# EAGLE design meter (EAGLE 9.1.3)
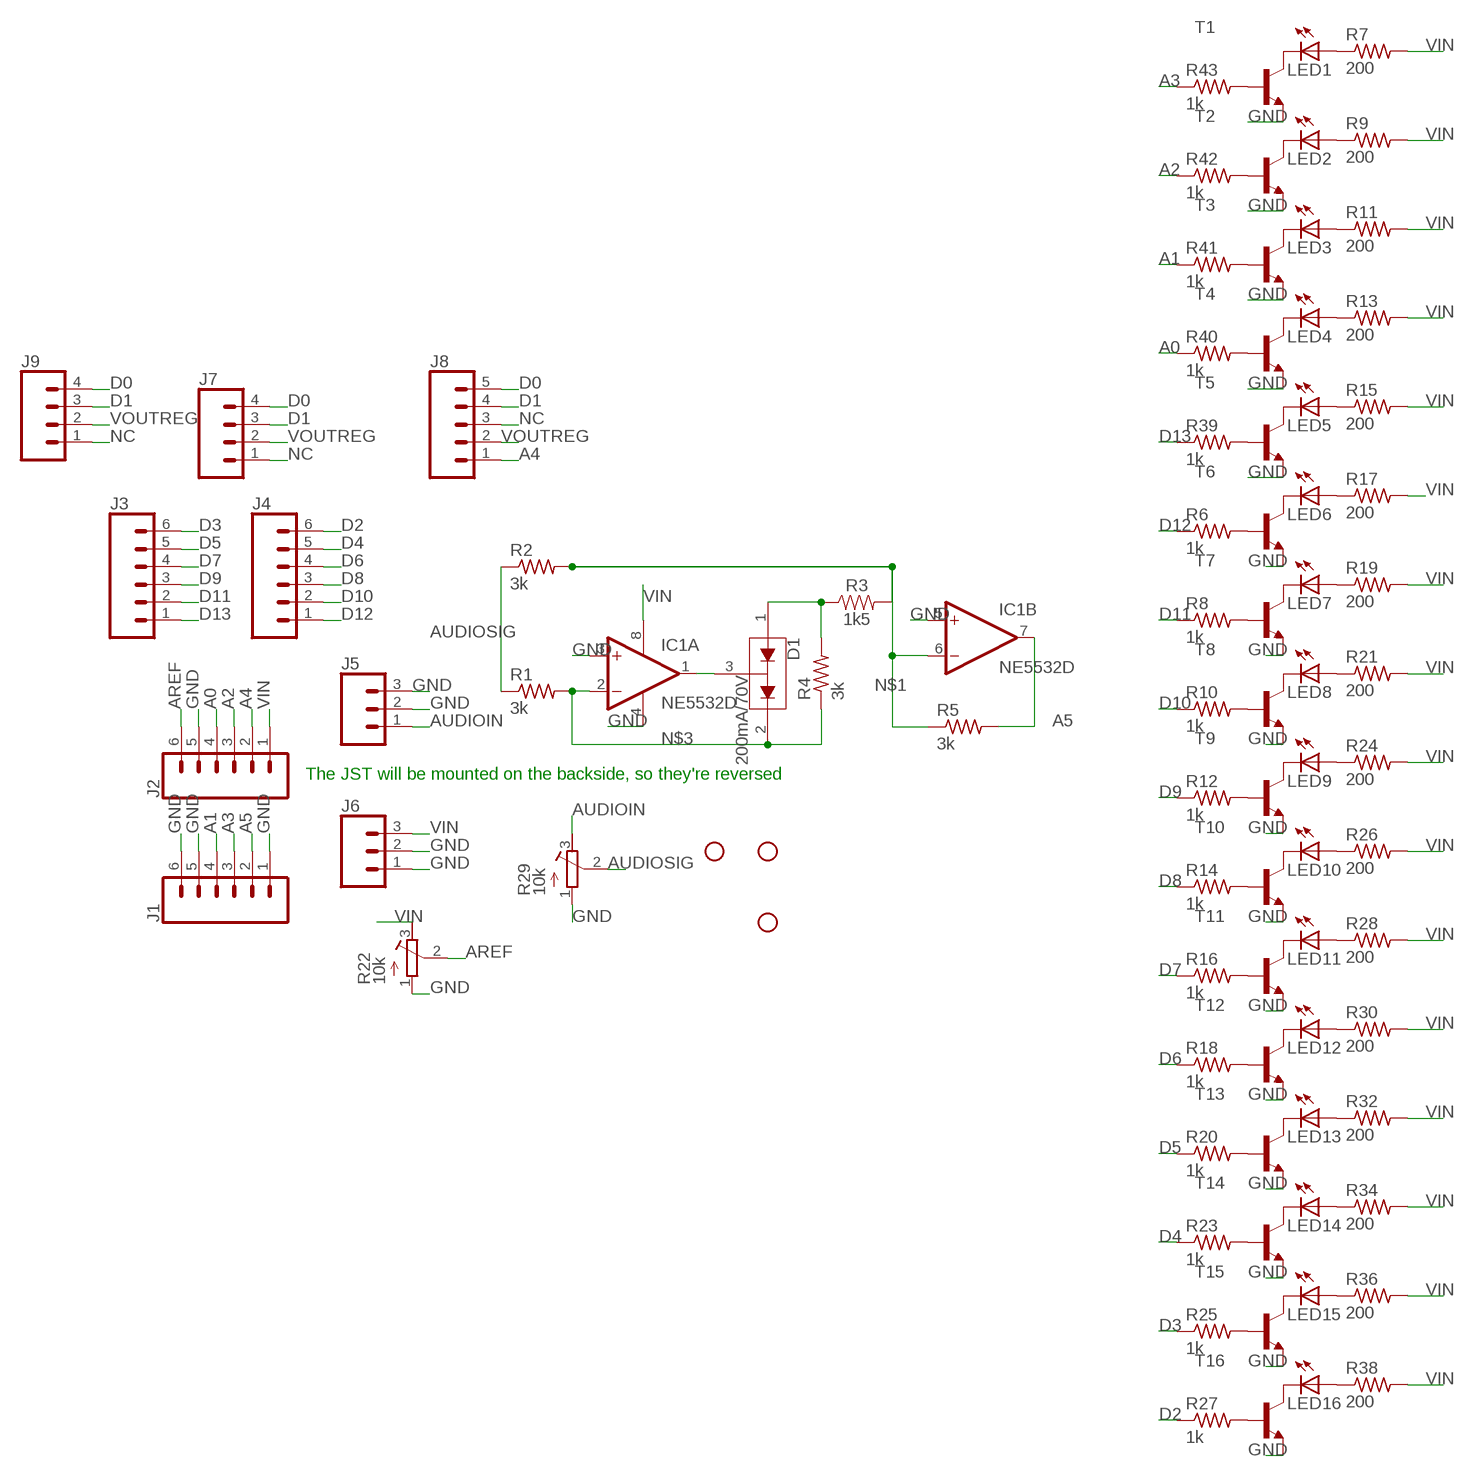
[diagram p0: schematic, sheet 1]

## Parts
D1  200mA/70V  BAV99  [SOT23-3]
H1  STAND-OFF  [STAND-OFF]
H2  STAND-OFF  [STAND-OFF]
H4  STAND-OFF  [STAND-OFF]
IC1  NE5532D  [SO08]
J1  CONN_061.27MM  [1X06_1.27MM]
J2  CONN_061.27MM  [1X06_1.27MM]
J3  CONN_061.27MM  [1X06_1.27MM]
J4  CONN_061.27MM  [1X06_1.27MM]
J5  CONN_03JST-PTH-VERT  [JST-3-PTH-VERT]
J6  CONN_03JST-PTH-VERT  [JST-3-PTH-VERT]
J7  CONN_041.27MM  [1X04_1.27MM]
J8  CONN_05NO_SILK  [1X05_NO_SILK]
J9  CONN_041.27MM  [1X04_1.27MM]
LED1  LEDCHIP-LED0805  [CHIP-LED0805]
LED2  LEDCHIP-LED0805  [CHIP-LED0805]
LED3  LEDCHIP-LED0805  [CHIP-LED0805]
LED4  LEDCHIP-LED0805  [CHIP-LED0805]
LED5  LEDCHIP-LED0805  [CHIP-LED0805]
LED6  LEDCHIP-LED0805  [CHIP-LED0805]
LED7  LEDCHIP-LED0805  [CHIP-LED0805]
LED8  LEDCHIP-LED0805  [CHIP-LED0805]
LED9  LEDCHIP-LED0805  [CHIP-LED0805]
LED10  LEDCHIP-LED0805  [CHIP-LED0805]
LED11  LEDCHIP-LED0805  [CHIP-LED0805]
LED12  LEDCHIP-LED0805  [CHIP-LED0805]
LED13  LEDCHIP-LED0805  [CHIP-LED0805]
LED14  LEDCHIP-LED0805  [CHIP-LED0805]
LED15  LEDCHIP-LED0805  [CHIP-LED0805]
LED16  LEDCHIP-LED0805  [CHIP-LED0805]
R1  3k  R-US_R0805  [R0805]
R2  3k  R-US_R0805  [R0805]
R3  1k5  RESISTOR1206  [1206]
R4  3k  R-US_R0805  [R0805]
R5  3k  R-US_R0805  [R0805]
R6  1k  R-US_R0805  [R0805]
R7  200  R-US_R0805  [R0805]
R8  1k  R-US_R0805  [R0805]
R9  200  R-US_R0805  [R0805]
R10  1k  R-US_R0805  [R0805]
R11  200  R-US_R0805  [R0805]
R12  1k  R-US_R0805  [R0805]
R13  200  R-US_R0805  [R0805]
R14  1k  R-US_R0805  [R0805]
R15  200  R-US_R0805  [R0805]
R16  1k  R-US_R0805  [R0805]
R17  200  R-US_R0805  [R0805]
R18  1k  R-US_R0805  [R0805]
R19  200  R-US_R0805  [R0805]
R20  1k  R-US_R0805  [R0805]
R21  200  R-US_R0805  [R0805]
R22  10k  R-TRIMM3296Y  [RTRIM3296Y]
R23  1k  R-US_R0805  [R0805]
R24  200  R-US_R0805  [R0805]
R25  1k  R-US_R0805  [R0805]
R26  200  R-US_R0805  [R0805]
R27  1k  R-US_R0805  [R0805]
R28  200  R-US_R0805  [R0805]
R29  10k  R-TRIMM3296Y  [RTRIM3296Y]
R30  200  R-US_R0805  [R0805]
R32  200  R-US_R0805  [R0805]
R34  200  R-US_R0805  [R0805]
R36  200  R-US_R0805  [R0805]
R38  200  R-US_R0805  [R0805]
R39  1k  R-US_R0805  [R0805]
R40  1k  R-US_R0805  [R0805]
R41  1k  R-US_R0805  [R0805]
R42  1k  R-US_R0805  [R0805]
R43  1k  R-US_R0805  [R0805]
T1  BCX56-NPN-SOT89-BCE  [SOT89-BCE]
T2  BCX56-NPN-SOT89-BCE  [SOT89-BCE]
T3  BCX56-NPN-SOT89-BCE  [SOT89-BCE]
T4  BCX56-NPN-SOT89-BCE  [SOT89-BCE]
T5  BCX56-NPN-SOT89-BCE  [SOT89-BCE]
T6  BCX56-NPN-SOT89-BCE  [SOT89-BCE]
T7  BCX56-NPN-SOT89-BCE  [SOT89-BCE]
T8  BCX56-NPN-SOT89-BCE  [SOT89-BCE]
T9  BCX56-NPN-SOT89-BCE  [SOT89-BCE]
T10  BCX56-NPN-SOT89-BCE  [SOT89-BCE]
T11  BCX56-NPN-SOT89-BCE  [SOT89-BCE]
T12  BCX56-NPN-SOT89-BCE  [SOT89-BCE]
T13  BCX56-NPN-SOT89-BCE  [SOT89-BCE]
T14  BCX56-NPN-SOT89-BCE  [SOT89-BCE]
T15  BCX56-NPN-SOT89-BCE  [SOT89-BCE]
T16  BCX56-NPN-SOT89-BCE  [SOT89-BCE]

## Nets
A0: J2.4 R40.1
A1: J1.4 R41.1
A2: J2.3 R42.1
A3: J1.3 R43.1
A4: J2.2 J8.1
A5: IC1.7(B:OUT) J1.2 R5.2
AREF: J2.6 R22.2(S)
AUDIOIN: J5.1 R29.3(E)
AUDIOSIG: R1.1 R2.1 R29.2(S)
D0: J7.4 J8.5 J9.4
D1: J7.3 J8.4 J9.3
D2: J4.6 R27.1
D3: J3.6 R25.1
D4: J4.5 R23.1
D5: J3.5 R20.1
D6: J4.4 R18.1
D7: J3.4 R16.1
D8: J4.3 R14.1
D9: J3.3 R12.1
D10: J4.2 R10.1
D11: J3.2 R8.1
D12: J4.1 R6.1
D13: J3.1 R39.1
GND: IC1.3(A:+IN) IC1.4(P:V-) IC1.5(B:+IN) J1.1 J1.5 J1.6 J2.5 J5.2 J5.3 J6.1 J6.2 R22.1(A) R29.1(A) T1.E T2.E T3.E T4.E T5.E T6.E T7.E T8.E T9.E T10.E T11.E T12.E T13.E T14.E T15.E T16.E
N$1: IC1.6(B:-IN) R2.2 R3.2 R5.1
N$2: D1.3(COM) IC1.1(A:OUT)
N$3: D1.2(C2) IC1.2(A:-IN) R1.2 R4.1
N$4: D1.1(A1) R3.1 R4.2
N$5: R43.2 T1.B
N$6: LED1.C T1.C
N$7: LED1.A R7.1
N$8: LED2.C T2.C
N$9: LED2.A R9.1
N$10: R42.2 T2.B
N$11: LED3.C T3.C
N$12: LED3.A R11.1
N$13: R41.2 T3.B
N$14: LED4.C T4.C
N$15: LED4.A R13.1
N$16: R40.2 T4.B
N$17: LED5.C T5.C
N$18: LED5.A R15.1
N$19: R39.2 T5.B
N$20: LED6.C T6.C
N$21: LED6.A R17.1
N$22: R6.2 T6.B
N$23: LED7.C T7.C
N$24: LED7.A R19.1
N$25: R8.2 T7.B
N$26: LED8.C T8.C
N$27: LED8.A R21.1
N$28: R10.2 T8.B
N$29: LED9.C T9.C
N$30: LED9.A R24.1
N$31: R12.2 T9.B
N$32: LED10.C T10.C
N$33: LED10.A R26.1
N$34: R14.2 T10.B
N$35: LED11.C T11.C
N$36: LED11.A R28.1
N$37: R16.2 T11.B
N$38: LED12.C T12.C
N$39: LED12.A R30.1
N$40: R18.2 T12.B
N$41: LED13.C T13.C
N$42: LED13.A R32.1
N$43: R20.2 T13.B
N$44: LED14.C T14.C
N$45: LED14.A R34.1
N$46: R23.2 T14.B
N$47: LED15.C T15.C
N$48: LED15.A R36.1
N$49: R25.2 T15.B
N$50: LED16.C T16.C
N$51: LED16.A R38.1
N$52: R27.2 T16.B
NC: J7.1 J8.3 J9.1
VIN: IC1.8(P:V+) J2.1 J6.3 R7.2 R9.2 R11.2 R13.2 R15.2 R17.2 R19.2 R21.2 R22.3(E) R24.2 R26.2 R28.2 R30.2 R32.2 R34.2 R36.2 R38.2
VOUTREG: J7.2 J8.2 J9.2

## Notes on the sheet
- The JST will be mounted on the backside, so they're reversed

## Library data of the parts
D1 = SparkFun-DiscreteSemi:BAV99: Series-pair diode array Two small signal silicon diodes connected anode to cathode. Connections to all three nodes available. Link to datasheet <https://www.fairchildsemi.com/datasheets/BA/BAV99.pdf> SparkFun Products: SparkFun AutoDriver <https://www.sparkfun.com/products/13752>; PROD_ID: DIO-10647
H1 H2 H4 = SparkFun-Hardware:STAND-OFF: Stand Off Drill holes for mechanically mounting via screws, standoffs, etc. Note: Use the keepout ring to avoid running the screw head into surrounding components. Variant Overviews STAND-OFF - Mechanical footprint for a #4 phillips button head screw. STAND-OFF-TIGHT - Mechanical footprint for a #4 phillips button head screw, Example SparkFun Products Screw - Phillips Head (1/4", 4-40, 10 pack) <https://www.sparkfun.com/products/10453> (PRT-10453) Screw - Phillips Head (1/2", 4-40, 10 pack) <https://www.sparkfun.com/products/10452> (PRT-10452) Screw - Phillips Head (3/4", 4-40, 10 pack) <https://www.sparkfun.com/products/10451> (PRT-10451) Screw - Phillips Head (1", 4-40, 10 pack) <https://www.sparkfun.com/products/10450> (PRT-10450)
IC1 = linear:NE5532: AUDIO AMPLIFIER
J1-J4 = SparkFun-Connectors:CONN_06: Multi connection point. Often used as Generic Header-pin footprint for 0.1 inch spaced/style header connections On any of the 0.1 inch spaced packages, you can populate with these: Break Away Headers - Straight <https://www.sparkfun.com/products/116> (PRT-00116) Break Away Male Headers - Right Angle <https://www.sparkfun.com/products/553> (PRT-00553) Female Headers <https://www.sparkfun.com/products/115> (PRT-00115) Break Away Headers - Machine Pin <https://www.sparkfun.com/products/117> (PRT-00117) Break Away Female Headers - Swiss Machine Pin <https://www.sparkfun.com/products/743> (PRT-00743) Arduino Stackable Header - 6 Pin <https://www.sparkfun.com/products/9280> (PRT-09280) For SCREWTERMINALS and SPRING TERMINALS visit here: Screw Terimnals on SparkFun.com <https://www.sparkfun.com/search/results?term=Screw+Terminals> (5mm/3.5mm/2.54mm spacing) This device is also useful as a general connection point to wire up your design to another part of your project. Our various solder wires solder well into these plated through hole pads. Hook-Up Wire - Assortment (Stranded, 22 AWG) <https://www.sparkfun.com/products/11375> (PRT-11375) Hook-Up Wire - Assortment (Solid Core, 22 AWG) <https://www.sparkfun.com/products/11367> (PRT-11367) View the entire wire category on our website here <https://www.sparkfun.com/categories/141>
J5 J6 = SparkFun-Connectors:CONN_03: Multi connection point. Often used as Generic Header-pin footprint for 0.1 inch spaced/style header connections On any of the 0.1 inch spaced packages, you can populate with these: Break Away Headers - Straight <https://www.sparkfun.com/products/116> (PRT-00116) Break Away Male Headers - Right Angle <https://www.sparkfun.com/products/553> (PRT-00553) Female Headers <https://www.sparkfun.com/products/115> (PRT-00115) Break Away Headers - Machine Pin <https://www.sparkfun.com/products/117> (PRT-00117) Break Away Female Headers - Swiss Machine Pin <https://www.sparkfun.com/products/743> (PRT-00743) Stackable Header - 3 Pin (Female, 0.1") <https://www.sparkfun.com/products/13875> (PRT-13875) For SCREWTERMINALS and SPRING TERMINALS visit here: Screw Terimnals on SparkFun.com <https://www.sparkfun.com/search/results?term=Screw+Terminals> (5mm/3.5mm/2.54mm spacing) This device is also useful as a general connection point to wire up your design to another part of your project. Our various solder wires solder well into these plated through hole pads. Hook-Up Wire - Assortment (Stranded, 22 AWG) <https://www.sparkfun.com/products/11375> (PRT-11375) Hook-Up Wire - Assortment (Solid Core, 22 AWG) <https://www.sparkfun.com/products/11367> (PRT-11367) View the entire wire category on our website here <https://www.sparkfun.com/categories/141> Special notes: Molex polarized connector foot print use with SKU : PRT-08232 with associated crimp pins and housings.; PROD_ID: CONN-13230
J7 J9 = SparkFun-Connectors:CONN_04: Multi connection point. Often used as Generic Header-pin footprint for 0.1 inch spaced/style header connections On any of the 0.1 inch spaced packages, you can populate with these: Break Away Headers - Straight <https://www.sparkfun.com/products/116> (PRT-00116) Break Away Male Headers - Right Angle <https://www.sparkfun.com/products/553> (PRT-00553) Female Headers <https://www.sparkfun.com/products/115> (PRT-00115) Break Away Headers - Machine Pin <https://www.sparkfun.com/products/117> (PRT-00117) Break Away Female Headers - Swiss Machine Pin <https://www.sparkfun.com/products/743> (PRT-00743) For SCREWTERMINALS and SPRING TERMINALS visit here: Screw Terimnals on SparkFun.com <https://www.sparkfun.com/search/results?term=Screw+Terminals> (5mm/3.5mm/2.54mm spacing) This device is also useful as a general connection point to wire up your design to another part of your project. Our various solder wires solder well into these plated through hole pads. Hook-Up Wire - Assortment (Stranded, 22 AWG) <https://www.sparkfun.com/products/11375> (PRT-11375) Hook-Up Wire - Assortment (Solid Core, 22 AWG) <https://www.sparkfun.com/products/11367> (PRT-11367) View the entire wire category on our website here <https://www.sparkfun.com/categories/141> Special notes: Molex polarized connector foot print use with SKU : PRT-08231 with associated crimp pins and housings. 1MM SMD Version SKU: PRT-10208
J8 = SparkFun-Connectors:CONN_05: Multi connection point. Often used as Generic Header-pin footprint for 0.1 inch spaced/style header connections On any of the 0.1 inch spaced packages, you can populate with these: Break Away Headers - Straight <https://www.sparkfun.com/products/116> (PRT-00116) Break Away Male Headers - Right Angle <https://www.sparkfun.com/products/553> (PRT-00553) Female Headers <https://www.sparkfun.com/products/115> (PRT-00115) Break Away Headers - Machine Pin <https://www.sparkfun.com/products/117> (PRT-00117) Break Away Female Headers - Swiss Machine Pin <https://www.sparkfun.com/products/743> (PRT-00743) For SCREWTERMINALS and SPRING TERMINALS visit here: Screw Terimnals on SparkFun.com <https://www.sparkfun.com/search/results?term=Screw+Terminals> (5mm/3.5mm/2.54mm spacing) This device is also useful as a general connection point to wire up your design to another part of your project. Our various solder wires solder well into these plated through hole pads. Hook-Up Wire - Assortment (Stranded, 22 AWG) <https://www.sparkfun.com/products/11375> (PRT-11375) Hook-Up Wire - Assortment (Solid Core, 22 AWG) <https://www.sparkfun.com/products/11367> (PRT-11367) View the entire wire category on our website here <https://www.sparkfun.com/categories/141> Special notes: Molex polarized connector foot print use with SKU : PRT-08231 with associated crimp pins and housings. 1MM SMD Version SKU: PRT-10208
LED1-LED16 = led:LED: LED OSRAM: - CHIPLED LG R971, LG N971, LY N971, LG Q971, LY Q971, LO R971, LY R971 LH N974, LH R974 LS Q976, LO Q976, LY Q976 LO Q996 - Hyper CHIPLED LW Q18S LB Q993, LB Q99A, LB R99A - SideLED LS A670, LO A670, LY A670, LG A670, LP A670 LB A673, LV A673, LT A673, LW A673 LH A674 LY A675 LS A676, LA A676, LO A676, LY A676, LW A676 LS A679, LY A679, LG A679 - Hyper Micro SIDELED® LS Y876, LA Y876, LO Y876, LY Y876 LT Y87S - SmartLED LW L88C, LW L88S LB L89C, LB L89S, LG L890 LS L89K, LO L89K, LY L89K LS L896, LA L896, LO L896, LY L896 - TOPLED LS T670, LO T670, LY T670, LG T670, LP T670 LSG T670, LSP T670, LSY T670, LOP T670, LYG T670 LG T671, LOG T671, LSG T671 LB T673, LV T673, LT T673, LW T673 LH T674 LS T676, LA T676, LO T676, LY T676, LB T676, LH T676, LSB T676, LW T676 LB T67C, LV T67C, LT T67C, LS T67K, LO T67K, LY T67K, LW E67C LS E67B, LA E67B, LO E67B, LY E67B, LB E67C, LV E67C, LT E67C LW T67C LS T679, LY T679, LG T679 LS T770, LO T770, LY T770, LG T770, LP T770 LB T773, LV T773, LT T773, LW T773 LH T774 LS E675, LA E675, LY E675, LS T675 LS T776, LA T776, LO T776, LY T776, LB T776 LHGB T686 LT T68C, LB T68C - Hyper Mini TOPLED® LB M676 - Mini TOPLED Santana® LG M470 LS M47K, LO M47K, LY M47K Source: http://www.osram.convergy.de LUXEON: - LUMILED® LXK2-PW12-R00, LXK2-PW12-S00, LXK2-PW14-U00, LXK2-PW14-V00 LXK2-PM12-R00, LXK2-PM12-S00, LXK2-PM14-U00 LXK2-PE12-Q00, LXK2-PE12-R00, LXK2-PE12-S00, LXK2-PE14-T00, LXK2-PE14-U00 LXK2-PB12-K00, LXK2-PB12-L00, LXK2-PB12-M00, LXK2-PB14-N00, LXK2-PB14-P00, LXK2-PB14-Q00 LXK2-PR12-L00, LXK2-PR12-M00, LXK2-PR14-Q00, LXK2-PR14-R00 LXK2-PD12-Q00, LXK2-PD12-R00, LXK2-PD12-S00 LXK2-PH12-R00, LXK2-PH12-S00 LXK2-PL12-P00, LXK2-PL12-Q00, LXK2-PL12-R00 Source: www.luxeon.com KINGBRIGHT: KA-3528ASYC Source: www.kingbright.com
R1 R2 R4-R21 R23-R28 R30 R32 R34 R36 R38-R43 = resistor:R-US_: RESISTOR, American symbol
R3 = SparkFun-Resistors:RESISTOR: Generic Resistor Package
R22 R29 = resistor:R-TRIMM: Trimm resistor
T1-T16 = transistor-neu-to92:*-NPN-: NPN Transistror

## Board
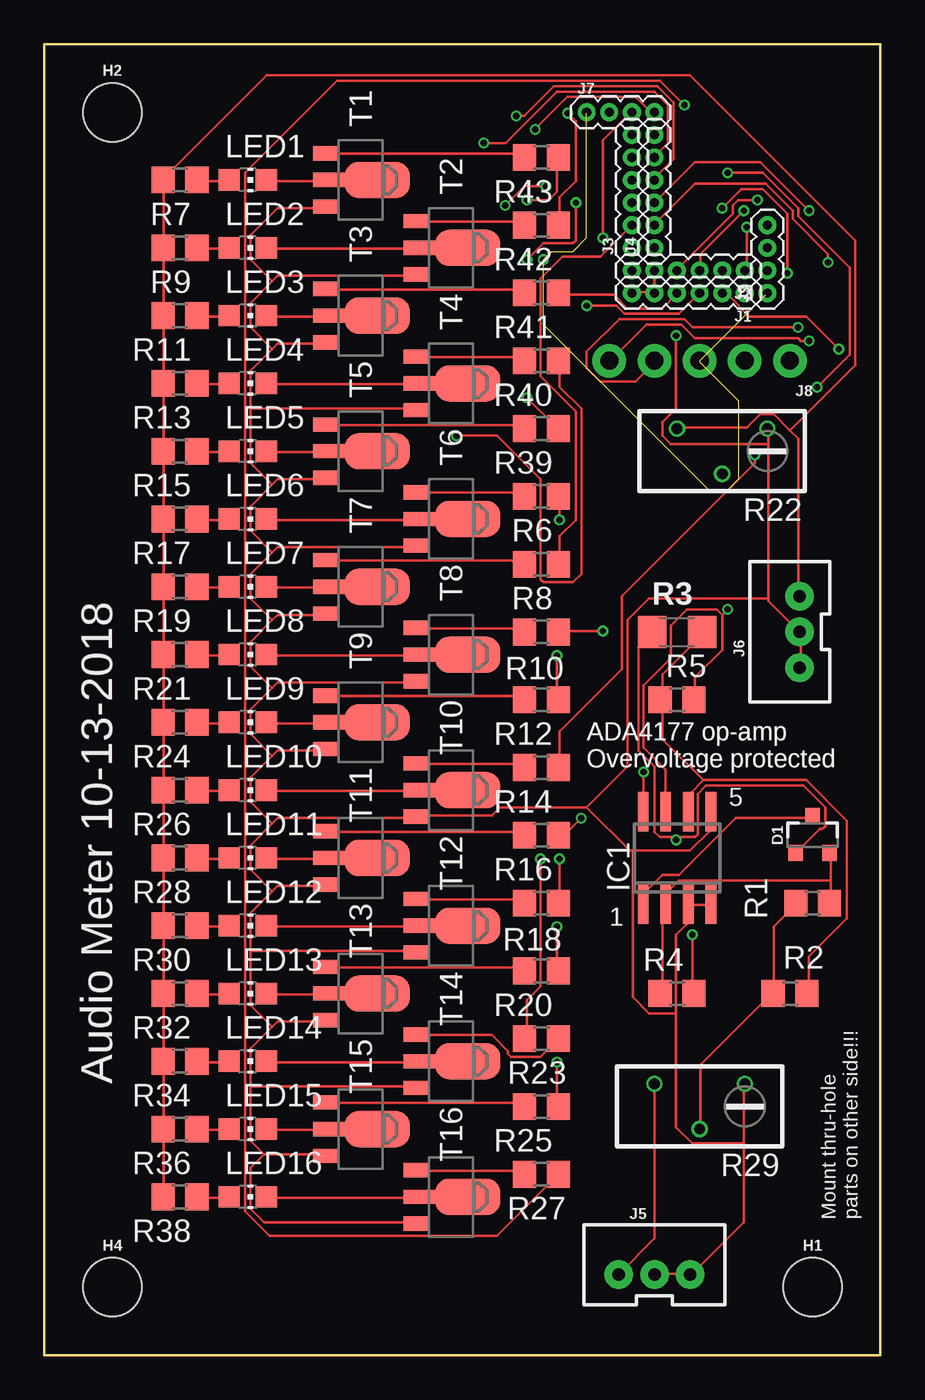
[diagram p1: board, top side]
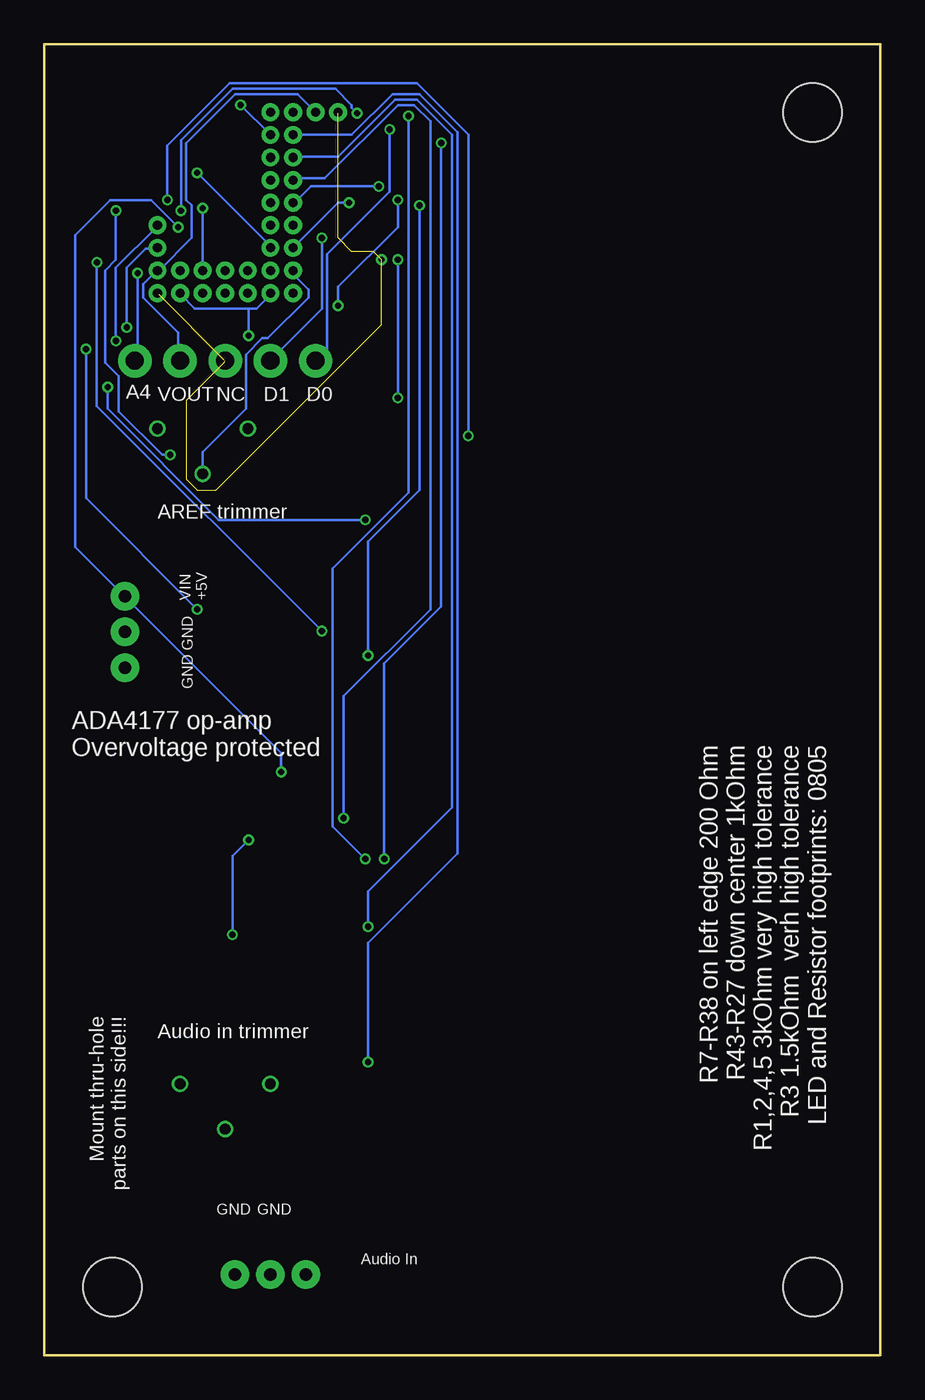
[diagram p2: board, bottom side, seen from below]

Size 46.99 x 73.66 mm. Coordinates in mm from the lower left corner, seen from the top.
Outline: 0,0 46.99,0 46.99,73.66 0,73.66 0,0
Copper layers (1*16): Top 0.035559375mm / dielectric 1.6mm / Bottom 0.035559375mm
Design rules "oshpark-2layer": minimum track width 6mil, minimum drill 10mil, track to track 6mil, track to pad 6mil, pad to pad 6mil, via to via 6mil, smd to smd 6mil, copper to edge 15mil, drill to drill 6mil, minimum pad ring 5mil, minimum via ring 5mil, stop-mask expansion 2.5mil, vias tented up to drill 0mil, thermal gap 10mil

### Footprints (pad centres in the part's own frame; a part is rotated, then mirrored left to right if it is on the bottom)
SOT23-3 = smd 0.8 x 0.9: 1 -0.95,-1; 2 0.95,-1; 3 0,1.1
STAND-OFF = hole 3.302: 0,0
SO08 = smd 0.6 x 2.2: 1 -1.905,-2.6; 2 -0.635,-2.6; 3 0.635,-2.6; 4 1.905,-2.6; 5 1.905,2.6; 6 0.635,2.6; 7 -0.635,2.6; 8 -1.905,2.6
1X06_1.27MM = drill 0.508 pad 1: 1 0,0; 2 1.27,0; 3 2.54,0; 4 3.81,0; 5 5.08,0; 6 6.35,0
JST-3-PTH-VERT = drill 0.7 pad 1.6: 1 -2,-0.55; 2 0,-0.55; 3 2,-0.55
1X04_1.27MM = drill 0.508 pad 1: 1 0,0; 2 1.27,0; 3 2.54,0; 4 3.81,0
1X05_NO_SILK = drill 1.016 pad 1.88: 1 0,0; 2 2.54,0; 3 5.08,0; 4 7.62,0; 5 10.16,0
CHIP-LED0805 = smd 1.2 x 1.2: A 0,-1.05; C 0,1.05
R0805 = smd 1.3 x 1.5: 1 -0.95,0; 2 0.95,0
1206 = smd 1.6 x 1.8: 1 -1.4,0; 2 1.4,0
RTRIM3296Y = drill 0.61: 1 1.27,-2.54; 2 -1.27,0; 3 1.27,2.54
SOT89-BCE = smd 0.8 x 1.4: B -1.499,-1.981; E 1.499,-1.981 | smd 0.8 x 1.9: C 0,-1.727 | smd 2.032 x 3.65: C@1 0,0.94

### Placement (x,y rotation side)
D1  43.18,29.21 0 top
H1  43.18,3.81 0 top
H2  3.81,69.85 0 top
H4  3.81,3.81 0 top
IC1  35.56,27.94 0 top
J1  39.37,59.69 180 top
J2  39.37,60.96 180 top
J3  33.02,62.23 90 top
J4  34.29,62.23 90 top
J5  34.29,5.08 0 top
J6  41.91,40.64 90 top
J7  30.48,69.85 0 top
J8  41.91,55.88 180 top
J9  40.64,59.69 90 top
LED1  11.43,66.04 270 top
LED2  11.43,62.23 270 top
LED3  11.43,58.42 270 top
LED4  11.43,54.61 270 top
LED5  11.43,50.8 270 top
LED6  11.43,46.99 270 top
LED7  11.43,43.18 270 top
LED8  11.43,39.37 270 top
LED9  11.43,35.56 270 top
LED10  11.43,31.75 270 top
LED11  11.43,27.94 270 top
LED12  11.43,24.13 270 top
LED13  11.43,20.32 270 top
LED14  11.43,16.51 270 top
LED15  11.43,12.7 270 top
LED16  11.43,8.89 270 top
R1  43.18,25.4 0 top
R2  41.91,20.32 0 top
R3  35.56,40.64 0 top
R4  35.56,20.32 0 top
R5  35.56,36.83 0 top
R6  27.94,48.26 180 top
R7  7.62,66.04 180 top
R8  27.94,44.45 180 top
R9  7.62,62.23 180 top
R10  27.94,40.64 180 top
R11  7.62,58.42 180 top
R12  27.94,36.83 180 top
R13  7.62,54.61 180 top
R14  27.94,33.02 180 top
R15  7.62,50.8 180 top
R16  27.94,29.21 180 top
R17  7.62,46.99 180 top
R18  27.94,25.4 180 top
R19  7.62,43.18 180 top
R20  27.94,21.59 180 top
R21  7.62,39.37 180 top
R22  38.1,50.8 90 top
R23  27.94,17.78 0 top
R24  7.62,35.56 180 top
R25  27.94,13.97 180 top
R26  7.62,31.75 180 top
R27  27.94,10.16 180 top
R28  7.62,27.94 180 top
R29  36.83,13.97 90 top
R30  7.62,24.13 180 top
R32  7.62,20.32 180 top
R34  7.62,16.51 180 top
R36  7.62,12.7 180 top
R38  7.62,8.89 180 top
R39  27.94,52.07 180 top
R40  27.94,55.88 180 top
R41  27.94,59.69 180 top
R42  27.94,63.5 180 top
R43  27.94,67.31 180 top
T1  17.78,66.04 270 top
T2  22.86,62.23 270 top
T3  17.78,58.42 270 top
T4  22.86,54.61 270 top
T5  17.78,50.8 270 top
T6  22.86,46.99 270 top
T7  17.78,43.18 270 top
T8  22.86,39.37 270 top
T9  17.78,35.56 270 top
T10  22.86,31.75 270 top
T11  17.78,27.94 270 top
T12  22.86,24.13 270 top
T13  17.78,20.32 270 top
T14  22.86,16.51 270 top
T15  17.78,12.7 270 top
T16  22.86,8.89 270 top

### Tracks (layer width: path | path; a pad name or v marks a point on that pad's centre or on a via)
A0  (via drill 0.35)
  Top 0.152: v23.16,51.66 25.45,51.66 27.89,49.23 27.89,43.59 28.04,43.43 29.72,43.43 30.18,43.89 30.18,53.19 28.96,54.41 28.96,55.78 R40.1 | v40.08,64.92 39.01,64.92 38.71,64.62 38.71,64.16 35.51,60.96 J2.4
  Bottom 0.152: v23.16,51.66 23.16,68.58 26.06,71.48 36.58,71.48 40.08,67.97 v40.08,64.92
A1
  Top 0.152: R41.1 28.96,59.59 32,59.59 32.77,58.83 34.75,58.83 35.51,59.59 J1.4
A2  (via drill 0.35)
  Top 0.152: v29.41,69.8 29.87,69.34 29.87,65.99 28.96,65.08 28.96,63.55 R42.1 | v39.32,64.31 36.88,61.87 36.88,60.96 J2.3
  Bottom 0.152: v29.41,69.8 29.72,70.1 29.72,70.26 30.63,71.17 36.42,71.17 39.32,68.28 v39.32,64.31
A3  (via drill 0.35)
  Top 0.152: v27.13,64.92 28.35,64.92 28.8,65.38 28.8,67.21 R43.1 | v30.48,58.98 32.16,58.98 32.61,58.52 35.66,58.52 36.73,59.59 J1.3
  Bottom 0.152: v27.13,64.92 27.13,63.4 30.48,60.05 v30.48,58.98
A4  (via drill 0.35)
  Top 0.152: v38.1,64.47 39.17,65.53 40.39,65.53 41.76,64.16 v41.76,60.81
  Bottom 0.152: v38.1,64.47 J2.2 | v41.76,60.81 41.76,56.08 41.91,55.93 J8.1
A5  (via drill 0.35)
  Top 0.152: 38.1,41.6 38.1,39.62 36.58,38.1 36.58,36.88 R5.2 | 38.1,41.6 37.8,41.91 36.12,41.91 35.2,41 35.2,39.17 33.68,37.64 33.68,34.14 34.9,32.92 34.9,30.63 IC1.7 | v44.65,56.54 42.82,58.37 39.62,58.37 38.41,59.59 38.1,59.59 J1.2 | 38.1,41.6 v38.41,41.91
  Bottom 0.152: v44.65,56.54 44.65,48.16 v38.41,41.91
AREF
  Bottom 0.152: R22.2 38.1,50.75 35.66,53.19 35.66,56.24 34.75,57.15 34.44,57.15 32.16,59.44 32.16,59.89 32.92,60.66 32.92,60.96 J2.6
AUDIOIN
  Top 0.152: R29.3 34.29,6.55 32.31,4.57 J5.1
AUDIOSIG
  Top 0.152: R1.1 42.22,25.3 41,24.08 41,20.42 R2.1 40.84,20.27 36.88,16.31 36.88,12.8 R29.2
D0  (via drill 0.35)
  Top 0.152: v42.98,57 42.52,57 42.37,57.15 36.58,57.15 35.81,57.91 33.83,57.91 31.85,55.93 J8.5 | v27.58,68.89 29.41,70.71 33.22,70.71 33.98,69.95 34.29,69.95 J7.4
  Bottom 0.152: v42.98,57 42.98,61.11 40.69,63.4 J9.4 | v27.58,68.89 27.58,65.38 31.09,61.87 31.09,56.54 31.7,55.93 J8.5
D1  (via drill 0.35)
  Top 0.152: v31.39,62.79 31.39,68.28 32.92,69.8 J7.3 | v42.37,57.76 36.42,57.76 35.97,58.22 32.31,58.22 30.48,56.39 30.48,55.47 31.24,54.71 33.22,54.71 34.29,55.78 J8.4
  Bottom 0.152: v31.39,62.79 31.39,58.83 34.29,55.93 J8.4 | v42.37,57.76 42.37,61.11 41.3,62.18 40.69,62.18 J9.3
D2  (via drill 0.35)
  Top 0.152: v35.97,70.26 34.59,71.63 16.46,71.63 11.28,66.45 11.28,8.08 12.65,6.71 25.45,6.71 28.8,10.06 R27.1
  Bottom 0.152: J4.6 v35.97,70.26
D3  (via drill 0.35)
  Top 0.152: v28.8,16.46 28.8,14.02 R25.1
  Bottom 0.152: v28.8,16.46 28.8,23.16 23.77,28.19 23.77,68.73 25.91,70.87 27.43,70.87 29.72,68.58 32.92,68.58 J3.6
D4  (via drill 0.35)
  Top 0.152: v27.89,27.89 27.89,20.73 27.13,19.96 27.13,17.83 R23.1 | v24.69,68.12 25.91,68.12 28.8,71.02 34.29,71.02 35.05,70.26 35.05,68.12 34.29,67.36 J4.5
  Bottom 0.152: v27.89,27.89 27.89,38.86 24.69,42.06 v24.69,68.12
D5  (via drill 0.35)
  Top 0.152: v28.8,24.08 28.8,21.64 R20.1
  Bottom 0.152: v28.8,24.08 28.8,26.06 24.08,30.79 24.08,68.58 26.06,70.56 27.28,70.56 30.48,67.36 32.92,67.36 J3.5
D6  (via drill 0.35)
  Top 0.152: v28.96,27.89 28.96,25.45 R18.1 | v26.52,69.65 26.98,69.65 28.65,71.32 34.44,71.32 35.36,70.41 35.36,67.21 34.29,66.14 J4.4
  Bottom 0.152: v28.96,27.89 30.79,29.72 30.79,44.2 26.52,48.46 v26.52,69.65
D7  (via drill 0.35)
  Top 0.152: v30.18,30.18 29.26,29.26 28.96,29.26 R16.1
  Bottom 0.152: v30.18,30.18 30.18,37.03 25.3,41.91 25.3,69.34 26.21,70.26 27.13,70.26 31.24,66.14 32.92,66.14 J3.4
D8  (via drill 0.35)
  Top 0.152: v39.93,50.6 39.93,50.14 32.46,42.67 32.46,38.56 28.96,35.05 28.96,33.07 R14.1 | v42.98,64.31 40.23,67.06 36.58,67.06 J4.3
  Bottom 0.152: v39.93,50.6 40.39,50.6 42.82,53.03 42.82,55.02 43.59,55.78 43.59,60.96 42.98,61.57 v42.98,64.31
D9  (via drill 0.35)
  Top 0.152: v28.8,39.32 28.8,36.88 R12.1 | v25.91,64.62 26.98,65.68 v28.19,65.68
  Bottom 0.152: v28.8,39.32 28.8,45.72 25.91,48.62 v25.91,64.62 | v28.19,65.68 32,65.68 32.92,64.77 J3.3
D10  (via drill 0.35)
  Top 0.152: v31.39,40.69 28.96,40.69 R10.1 | v44.04,61.42 44.04,61.87 42.06,63.86 42.06,64.31 40.54,65.84 36.58,65.84 34.29,63.55 J4.2
  Bottom 0.152: v31.39,40.69 44.04,53.34 v44.04,61.42
D11
  Top 0.152: R8.1 28.96,44.5 28.96,46.02 29.87,46.94 29.87,53.03 27.89,55.02 27.89,60.5 29.11,61.72 31.24,61.72 32.92,63.4 J3.2
D12  (via drill 0.35)
  Top 0.152: v28.96,46.94 28.96,48.16 R6.1 | v43.43,54.41 45.26,56.24 45.26,61.11 42.37,64.01 42.37,64.47 40.39,66.45 v38.41,66.45
  Bottom 0.152: v28.96,46.94 37.19,46.94 43.43,53.19 v43.43,54.41 | v38.41,66.45 34.29,62.33 J4.1
D13  (via drill 0.35)
  Top 0.152: v27.13,53.8 28.8,52.12 R39.1 | v27.13,61.57 28.04,62.48 29.72,62.48 29.87,62.64 v29.87,64.77
  Bottom 0.152: v27.13,61.57 v27.13,53.8 | v29.87,64.77 30.48,64.77 32.92,62.33 J3.1
GND  (via drill 0.35)
  Top 0.152: 34.29,59.74 33.07,59.74 J1.6 | 34.29,59.74 J1.5 34.29,59.74 | 34.29,59.74 J2.5 | 40.69,42.52 40.69,42.37 42.37,40.69 J6.2 42.52,40.54 42.52,38.71 J6.1 | 40.69,42.52 40.69,51.21 | 40.69,51.21 40.69,51.97 R22.1 | v35.51,57.3 35.51,53.19 34.75,52.43 34.75,51.66 35.2,51.21 40.69,51.21 | IC1.4 37.34,25.3 36.27,25.3 IC1.3 36.12,25.3 36.12,24.23 35.51,23.62 35.51,19.2 | 39.32,11.89 39.32,7.47 36.42,4.57 J5.3 36.27,4.57 34.29,4.57 J5.2 | 39.32,11.89 39.32,15.24 R29.1 | 35.51,19.2 35.51,12.8 36.42,11.89 39.32,11.89 | 12.34,11.28 15.7,11.28 T15.E | 12.34,11.28 11.58,12.04 11.58,15.09 | 11.58,15.09 11.58,17.22 12.8,18.44 | 12.8,18.44 13.11,18.75 15.7,18.75 T13.E | 12.8,26.06 11.58,24.84 11.58,22.71 | 12.8,26.06 13.11,26.36 15.7,26.36 T11.E | 11.58,22.71 11.58,19.66 12.8,18.44 | 12.34,11.28 11.58,10.52 11.58,8.23 12.34,7.47 20.88,7.47 T16.E | 11.58,15.09 20.88,15.09 T14.E | 11.58,22.71 20.88,22.71 T12.E | 12.8,29.87 11.58,28.65 11.58,27.28 12.8,26.06 | 12.8,29.87 13.11,30.18 20.88,30.18 T10.E 21.03,30.33 25.15,30.33 25.6,30.79 30.48,30.79 | 12.8,33.68 11.58,32.46 11.58,31.09 12.8,29.87 | 12.8,33.68 13.11,33.98 15.7,33.98 T9.E | 12.8,37.49 11.58,36.27 11.58,34.9 12.8,33.68 | 12.8,37.49 13.11,37.8 20.88,37.8 T8.E | 12.8,41.3 11.58,40.08 11.58,38.71 12.8,37.49 | 12.8,41.3 13.11,41.6 15.7,41.6 T7.E | 12.8,45.11 11.58,43.89 11.58,42.52 12.8,41.3 | 12.8,45.11 13.11,45.41 20.88,45.41 T6.E | 12.8,48.92 11.58,47.7 11.58,46.33 12.8,45.11 | 12.8,48.92 13.11,49.23 15.7,49.23 T5.E | 12.8,56.54 11.58,55.32 11.58,53.19 | 12.8,56.54 13.11,56.84 15.7,56.84 T3.E | 11.58,53.19 11.58,50.14 12.8,48.92 | 11.58,53.19 20.88,53.19 T4.E
  Top 0.152: 12.8,60.35 11.58,59.13 11.58,57.76 12.8,56.54 | 12.8,60.35 13.11,60.66 20.88,60.66 T2.E | 12.8,60.35 11.58,61.57 11.58,62.94 13.11,64.47 15.7,64.47 T1.E | 33.07,28.35 32.92,28.35 30.48,30.79 | 33.07,28.35 36.27,28.35 37.34,29.41 37.34,30.48 IC1.5 | 35.51,19.2 33.98,19.2 33.07,20.12 33.07,28.35 | 40.69,42.52 33.98,42.52 32.77,41.3 32.77,33.07 30.48,30.79
  Bottom 0.152: 35.51,58.83 35.05,58.83 34.29,59.59 J1.5 | 35.51,58.83 38.56,58.83 39.32,59.59 J1.1 | v35.51,57.3 35.51,58.83
N$1
  Top 0.152: R3.2 37.03,40.54 34.75,38.25 34.75,36.88 R5.1 34.75,36.73 34.75,34.59 37.03,32.31 | 37.03,32.31 42.82,32.31 45.11,30.02 45.11,24.54 42.98,22.4 42.98,20.42 R2.2 | 37.03,32.31 36.27,31.55 36.27,30.63 IC1.6
N$2
  Top 0.152: D1.3 43.13,30.18 38.86,30.18 35.66,26.98 34.75,26.98 33.68,25.91 33.68,25.45 IC1.1
N$3
  Top 0.152: 44.2,26.67 44.2,25.45 R1.2 | 44.2,26.67 44.2,28.19 D1.2 | R4.1 34.75,20.42 34.75,25.15 34.9,25.3 IC1.2 35.05,25.45 35.05,26.06 35.66,26.67 44.2,26.67
N$4  (via drill 0.35)
  Top 0.152: 35.51,29.11 34.59,29.11 34.29,29.41 34.29,33.07 33.38,33.98 33.38,39.78 34.14,40.54 R3.1 | 35.51,29.11 36.58,29.11 36.73,29.26 36.73,31.55 37.19,32 42.67,32 43.89,30.79 43.89,29.72 43.74,29.57 43.59,29.57 42.37,28.35 D1.1 | v36.42,23.62 36.42,20.42 R4.2 | 35.51,29.11 v35.51,28.96
  Bottom 0.152: v36.42,23.62 36.42,28.04 v35.51,28.96
N$5
  Top 0.152: T1.B 15.85,67.51 26.82,67.51 26.98,67.36 R43.2
N$6
  Top 0.152: LED1.C 12.5,65.99 16,65.99 T1.C
N$7
  Top 0.152: LED1.A 10.36,65.99 8.69,65.99 R7.1
N$8
  Top 0.152: LED2.C 12.5,62.18 21.03,62.18 T2.C
N$9
  Top 0.152: LED2.A 10.36,62.18 8.69,62.18 R9.1
N$10
  Top 0.152: T2.B 21.03,63.7 26.82,63.7 26.98,63.55 R42.2
N$11
  Top 0.152: LED3.C 12.5,58.37 16,58.37 T3.C
N$12
  Top 0.152: LED3.A 10.36,58.37 8.69,58.37 R11.1
N$13
  Top 0.152: T3.B 15.85,59.89 26.82,59.89 26.98,59.74 R41.2
N$14
  Top 0.152: LED4.C 12.5,54.56 21.03,54.56 T4.C
N$15
  Top 0.152: LED4.A 10.36,54.56 8.69,54.56 R13.1
N$16
  Top 0.152: T4.B 21.03,56.08 26.82,56.08 26.98,55.93 R40.2
N$17
  Top 0.152: LED5.C 12.5,50.75 16,50.75 T5.C
N$18
  Top 0.152: LED5.A 10.36,50.75 8.69,50.75 R15.1
N$19
  Top 0.152: T5.B 15.85,52.27 26.82,52.27 26.98,52.12 R39.2
N$20
  Top 0.152: LED6.C 12.5,46.94 21.03,46.94 T6.C
N$21
  Top 0.152: LED6.A 10.36,46.94 8.69,46.94 R17.1
N$22
  Top 0.152: T6.B 21.03,48.46 26.82,48.46 26.98,48.31 R6.2
N$23
  Top 0.152: LED7.C 12.5,43.13 16,43.13 T7.C
N$24
  Top 0.152: LED7.A 10.36,43.13 8.69,43.13 R19.1
N$25
  Top 0.152: T7.B 15.85,44.65 26.82,44.65 26.98,44.5 R8.2
N$26
  Top 0.152: LED8.C 12.5,39.32 21.03,39.32 T8.C
N$27
  Top 0.152: LED8.A 10.36,39.32 8.69,39.32 R21.1
N$28
  Top 0.152: T8.B 21.03,40.84 26.82,40.84 26.98,40.69 R10.2
N$29
  Top 0.152: LED9.C 12.5,35.51 16,35.51 T9.C
N$30
  Top 0.152: LED9.A 10.36,35.51 8.69,35.51 R24.1
N$31
  Top 0.152: T9.B 15.85,37.03 26.82,37.03 26.98,36.88 R12.2
N$32
  Top 0.152: LED10.C 12.5,31.7 21.03,31.7 T10.C
N$33
  Top 0.152: LED10.A 10.36,31.7 8.69,31.7 R26.1
N$34
  Top 0.152: T10.B 21.03,33.22 26.82,33.22 26.98,33.07 R14.2
N$35
  Top 0.152: LED11.C 12.5,27.89 16,27.89 T11.C
N$36
  Top 0.152: LED11.A 10.36,27.89 8.69,27.89 R28.1
N$37
  Top 0.152: T11.B 15.85,29.41 26.82,29.41 26.98,29.26 R16.2
N$38
  Top 0.152: LED12.C 12.5,24.08 21.03,24.08 T12.C
N$39
  Top 0.152: LED12.A 10.36,24.08 8.69,24.08 R30.1
N$40
  Top 0.152: T12.B 21.03,25.6 26.82,25.6 26.98,25.45 R18.2
N$41
  Top 0.152: LED13.C 12.5,20.27 16,20.27 T13.C
N$42
  Top 0.152: LED13.A 10.36,20.27 8.69,20.27 R32.1
N$43
  Top 0.152: T13.B 15.85,21.79 26.82,21.79 26.98,21.64 R20.2
N$44
  Top 0.152: LED14.C 12.5,16.46 21.03,16.46 T14.C
N$45
  Top 0.152: LED14.A 10.36,16.46 8.69,16.46 R34.1
N$46
  Top 0.152: T14.B 21.03,17.98 25.15,17.98 26.06,17.07 26.06,16.92 26.21,16.76 27.89,16.76 28.8,17.68 R23.2
N$47
  Top 0.152: LED15.C 12.5,12.65 16,12.65 T15.C
N$48
  Top 0.152: LED15.A 10.36,12.65 8.69,12.65 R36.1
N$49
  Top 0.152: T15.B 15.85,14.17 26.82,14.17 26.98,14.02 R25.2
N$50
  Top 0.152: LED16.C 12.5,8.84 21.03,8.84 T16.C
N$51
  Top 0.152: LED16.A 10.36,8.84 8.69,8.84 R38.1
N$52
  Top 0.152: T16.B 21.03,10.36 26.82,10.36 26.98,10.21 R27.2
NC  (via drill 0.35)  (12 unrouted)
  Top 0.152: 30.48,69.8 J7.1
  Bottom 0.152: 40.54,59.59 J9.1 | 36.88,55.93 J8.3
  other vias: 28.04,61.57
VIN  (via drill 0.35)
  Top 0.152: v39.47,63.4 39.47,60.96 J2.1 | v33.68,32.77 33.68,30.63 IC1.8 | 41.91,51.97 42.37,51.51 42.37,42.67 J6.3 | 41.91,51.97 41,52.88 40.23,52.88 39.47,52.12 35.66,52.12 R22.3 | R38.2 6.71,8.99 6.71,12.65 R36.2 6.71,12.8 6.71,16.46 R34.2 6.71,16.61 6.71,20.27 R32.2 6.71,20.42 6.71,24.08 R30.2 6.71,24.23 6.71,27.89 R28.2 6.71,28.04 6.71,31.7 R26.2 6.71,31.85 6.71,35.51 R24.2 6.71,35.66 6.71,39.32 R21.2 6.71,39.47 6.71,43.13 R19.2 6.71,43.28 6.71,46.94 R17.2 6.71,47.09 6.71,50.75 R15.2 6.71,50.9 6.71,54.56 R13.2 6.71,54.71 6.71,58.37 R11.2 6.71,58.52 6.71,62.18 R9.2 6.71,62.33 6.71,65.99 R7.2 6.71,66.14 12.5,71.93 36.27,71.93 45.57,62.64 45.57,55.63 41.91,51.97
  Bottom 0.152: v39.47,63.4 41,64.92 43.28,64.92 45.26,62.94 45.26,45.41 42.52,42.67 J6.3 42.37,42.52 33.68,33.83 v33.68,32.77
VOUTREG
  Bottom 0.152: J7.2 31.85,69.95 32.77,70.87 36.27,70.87 39.01,68.12 39.01,64.92 38.71,64.62 38.71,62.79 40.54,60.96 J9.2 40.69,60.96 41.45,60.2 41.45,59.44 39.47,57.45 39.47,55.93 J8.2

### Text on the board
tPlace: ADA4177 op-amp / Overvoltage protected | ADA4177 op-amp / Overvoltage protected | 5 | 1 | Audio Meter 10-13-2018 | Mount thru-hole / parts on other side!!!
bPlace: D0 | D1 | NC | VOUT | A4 | AREF trimmer | VIN / +5V | GND | GND | R7-R38 on left edge 200 Ohm / R43-R27 down center 1kOhm / R1,2,4,5 3kOhm very high tolerance / R3 1.5kOhm verh high tolerance / LED and Resistor footprints: 0805 | ADA4177 op-amp / Overvoltage protected | Mount thru-hole / parts on this side!!! | Audio in trimmer | GND | GND | Audio In